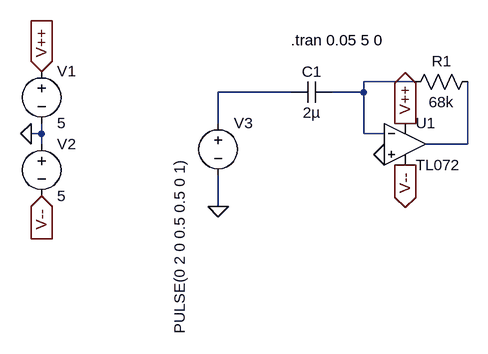
[diagram p0: schematic Differentiator.asc]
Differentiator.asc, the LTspice schematic file:
Version 4
SHEET 1 880 764
WIRE 528 288 448 288
WIRE 336 304 224 304
WIRE 448 304 448 288
WIRE 448 304 400 304
WIRE 224 352 224 304
WIRE -48 368 -48 352
WIRE -48 368 -64 368
WIRE 448 368 448 304
WIRE 480 368 448 368
WIRE -48 384 -48 368
WIRE 608 384 608 288
WIRE 608 384 544 384
WIRE 224 480 224 432
FLAG -64 368 0
FLAG -48 272 V++
IOPIN -48 272 In
FLAG -48 464 V--
IOPIN -48 464 In
FLAG 224 480 0
FLAG 512 416 V--
IOPIN 512 416 Out
FLAG 512 352 V++
IOPIN 512 352 Out
FLAG 480 400 0
SYMBOL Voltage -48 256 R0
SYMATTR InstName V1
SYMATTR Value 5
SYMBOL Voltage -48 368 R0
SYMATTR InstName V2
SYMATTR Value 5
SYMBOL OpAmps/TL072 512 320 R0
SYMATTR InstName U1
SYMBOL Voltage 224 336 R0
WINDOW 3 -59 70 VRight 2
SYMATTR InstName V3
SYMATTR Value PULSE(0 2 0 0.5 0.5 0 1)
SYMBOL Res 624 272 R90
WINDOW 0 0 56 VBottom 2
WINDOW 3 32 56 VTop 2
SYMATTR InstName R1
SYMATTR Value 68k
SYMBOL Cap 400 288 R90
WINDOW 0 0 32 VBottom 2
WINDOW 3 32 32 VTop 2
SYMATTR InstName C1
SYMATTR Value 2µ
TEXT 336 224 Left 2 !.tran 0.05 5 0

The netlist it stands for:
* Differentiator.asc
V1 V++ 0 5
V2 0 V-- 5
XU1 0 N001 V++ V-- N003 TL072  ; pins In+ In- V+ V- OUT
V3 N002 0 PULSE(0 2 0 0.5 0.5 0 1)
R1 N003 N001 68k
C1 N001 N002 2µ
.tran 0.05 5 0
.backanno
.end